# Altium schematic sheet audio_interface.SchDoc
size A4
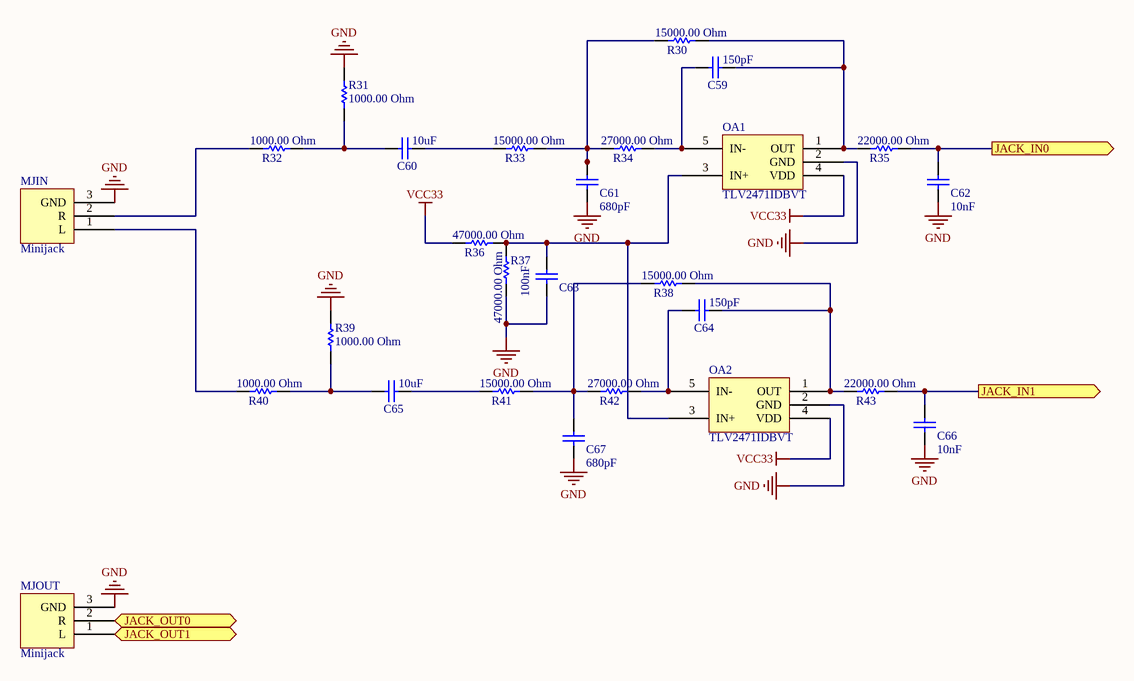
[diagram p0: audio_interface.SchDoc]

## Parts
C59  150pF  [CAPC0805(2012)75_M]
C60  10uF  [CAPC0805(2012)145_L]
C61  680pF  [CAPC0805(2012)100_M]
C62  10nF  [CAPC0805(2012)100_M]
C63  100nF  [CAPC0805(2012)100_M]
C64  150pF  [CAPC0805(2012)75_M]
C65  10uF  [CAPC0805(2012)145_L]
C66  10nF  [CAPC0805(2012)100_M]
C67  680pF  [CAPC0805(2012)100_M]
MJIN  Minijack  [MINIJACKS]
MJOUT  Minijack  [MINIJACKS]
OA1  TLV2471IDBVT  [TLV2471IDBVT]
OA2  TLV2471IDBVT  [TLV2471IDBVT]
R30  15000.00 Ohm  [RESC0805(2012)_M]
R31  1000.00 Ohm  [RESC0805(2012)_M]
R32  1000.00 Ohm  [RESC0805(2012)_M]
R33  15000.00 Ohm  [RESC0805(2012)_M]
R34  27000.00 Ohm  [RESC0805(2012)_M]
R35  22000.00 Ohm  [RESC0805(2012)_M]
R36  47000.00 Ohm  [RESC0805(2012)_M]
R37  47000.00 Ohm  [RESC0805(2012)_M]
R38  15000.00 Ohm  [RESC0805(2012)_M]
R39  1000.00 Ohm  [RESC0805(2012)_M]
R40  1000.00 Ohm  [RESC0805(2012)_M]
R41  15000.00 Ohm  [RESC0805(2012)_M]
R42  27000.00 Ohm  [RESC0805(2012)_M]
R43  22000.00 Ohm  [RESC0805(2012)_M]

## Ports
JACK_IN0 (out), JACK_IN1 (out), JACK_OUT0 (in), JACK_OUT1 (in)

## Nets
GND: C61.2 C62.2 C63.2 C66.2 C67.2 MJIN.3(GND) MJOUT.3(GND) OA1.2(GND) OA2.2(GND) R31.1 R37.2 R39.1
VCC33: OA1.4(VDD) OA2.4(VDD) R36.2
JACK_IN0: C62.1 R35.1 ; port JACK_IN0
JACK_IN1: C66.1 R43.1 ; port JACK_IN1
JACK_OUT0: MJOUT.2(R) ; port JACK_OUT0
JACK_OUT1: MJOUT.1(L) ; port JACK_OUT1
NetC59_1: C59.1 OA1.1(OUT) R30.1 R35.2
NetC59_2: C59.2 OA1.5(IN-) R34.1
NetC60_1: C60.1 R33.2
NetC60_2: C60.2 R31.2 R32.1
NetC61_1: C61.1 R30.2 R33.1 R34.2
NetC63_1: C63.1 OA1.3(IN+) OA2.3(IN+) R36.1 R37.1
NetC64_1: C64.1 OA2.1(OUT) R38.1 R43.2
NetC64_2: C64.2 OA2.5(IN-) R42.1
NetC65_1: C65.1 R41.2
NetC65_2: C65.2 R39.2 R40.1
NetC67_1: C67.1 R38.2 R41.1 R42.2
NetMJIN_1: MJIN.1(L) R40.2
NetMJIN_2: MJIN.2(R) R32.2

## Library data of the parts
C59 C64 = CMP-1036-02142-1: CAP 150pF 100V ±1% 0805 (2012 Metric) Thickness 0.75mm SMD; Case-Metric: 2012; Case-EIA: 0805; Rated Voltage: 100 V; Max Thickness: 0.75 mm; Tolerance: ±1%; Value: 150pF; Technology: SMT
C60 C65 = CMP-1036-04915-1: CAP 10uF 6.3V ±10% 0805 (2012 Metric) Thickness 1.45mm SMD; Case-Metric: 2012; Case-EIA: 0805; Rated Voltage: 6.3 V; Max Thickness: 1.45 mm; Tolerance: ±10%; Value: 10uF; Technology: SMT
C61 C67 = CMP-1036-02797-1: CAP 680pF 6.3V ±5% 0805 (2012 Metric) Thickness 1mm SMD; Case-Metric: 2012; Case-EIA: 0805; Rated Voltage: 6.3 V; Max Thickness: 1 mm; Tolerance: ±5%; Value: 680pF; Technology: SMT
C62 C66 = CMP-1036-03801-1: CAP 10nF 6.3V ±5% 0805 (2012 Metric) Thickness 1mm SMD; Case-Metric: 2012; Case-EIA: 0805; Rated Voltage: 6.3 V; Max Thickness: 1 mm; Tolerance: ±5%; Value: 10nF; Technology: SMT
C63 = CMP-1036-04390-1: CAP 100nF 6.3V ±5% 0805 (2012 Metric) Thickness 1mm SMD; Case-Metric: 2012; Case-EIA: 0805; Rated Voltage: 6.3 V; Max Thickness: 1 mm; Tolerance: ±5%; Value: 100nF; Technology: SMT
R30 R33 R38 R41 = CMP-1013-00641-1: 15K 0.125W 1% 0805 (2012 Metric)  SMD; Case-EIA: 0805; Case-Metric: 2012; Value: 15000.00 Ohm; Power: 0.125 W; Tolerance: 1 %; Technology: SMT
R31 R32 R39 R40 = CMP-1013-00510-1: 1K 0.125W 1% 0805 (2012 Metric)  SMD; Case-EIA: 0805; Case-Metric: 2012; Value: 1000.00 Ohm; Power: 0.125 W; Tolerance: 1 %; Technology: SMT
R34 R42 = CMP-1013-00670-1: 27K 0.125W 1% 0805 (2012 Metric)  SMD; Case-EIA: 0805; Case-Metric: 2012; Value: 27000.00 Ohm; Power: 0.125 W; Tolerance: 1 %; Technology: SMT
R35 R43 = CMP-1013-00659-1: 22K 0.125W 1% 0805 (2012 Metric)  SMD; Case-EIA: 0805; Case-Metric: 2012; Value: 22000.00 Ohm; Power: 0.125 W; Tolerance: 1 %; Technology: SMT
R36 R37 = CMP-1013-00699-1: 47K 0.125W 1% 0805 (2012 Metric)  SMD; Case-EIA: 0805; Case-Metric: 2012; Value: 47000.00 Ohm; Power: 0.125 W; Tolerance: 1 %; Technology: SMT